# Altium schematic sheet FMC_Block_Diagram.SchDoc: FMC Block Diagram
size 381 x 241 mm; DrawnBy: Connor Dack; Engineer: Connor Dack; DocumentNumber: 5; Revision: 1.0; SheetNumber: 5; SheetTotal: 20
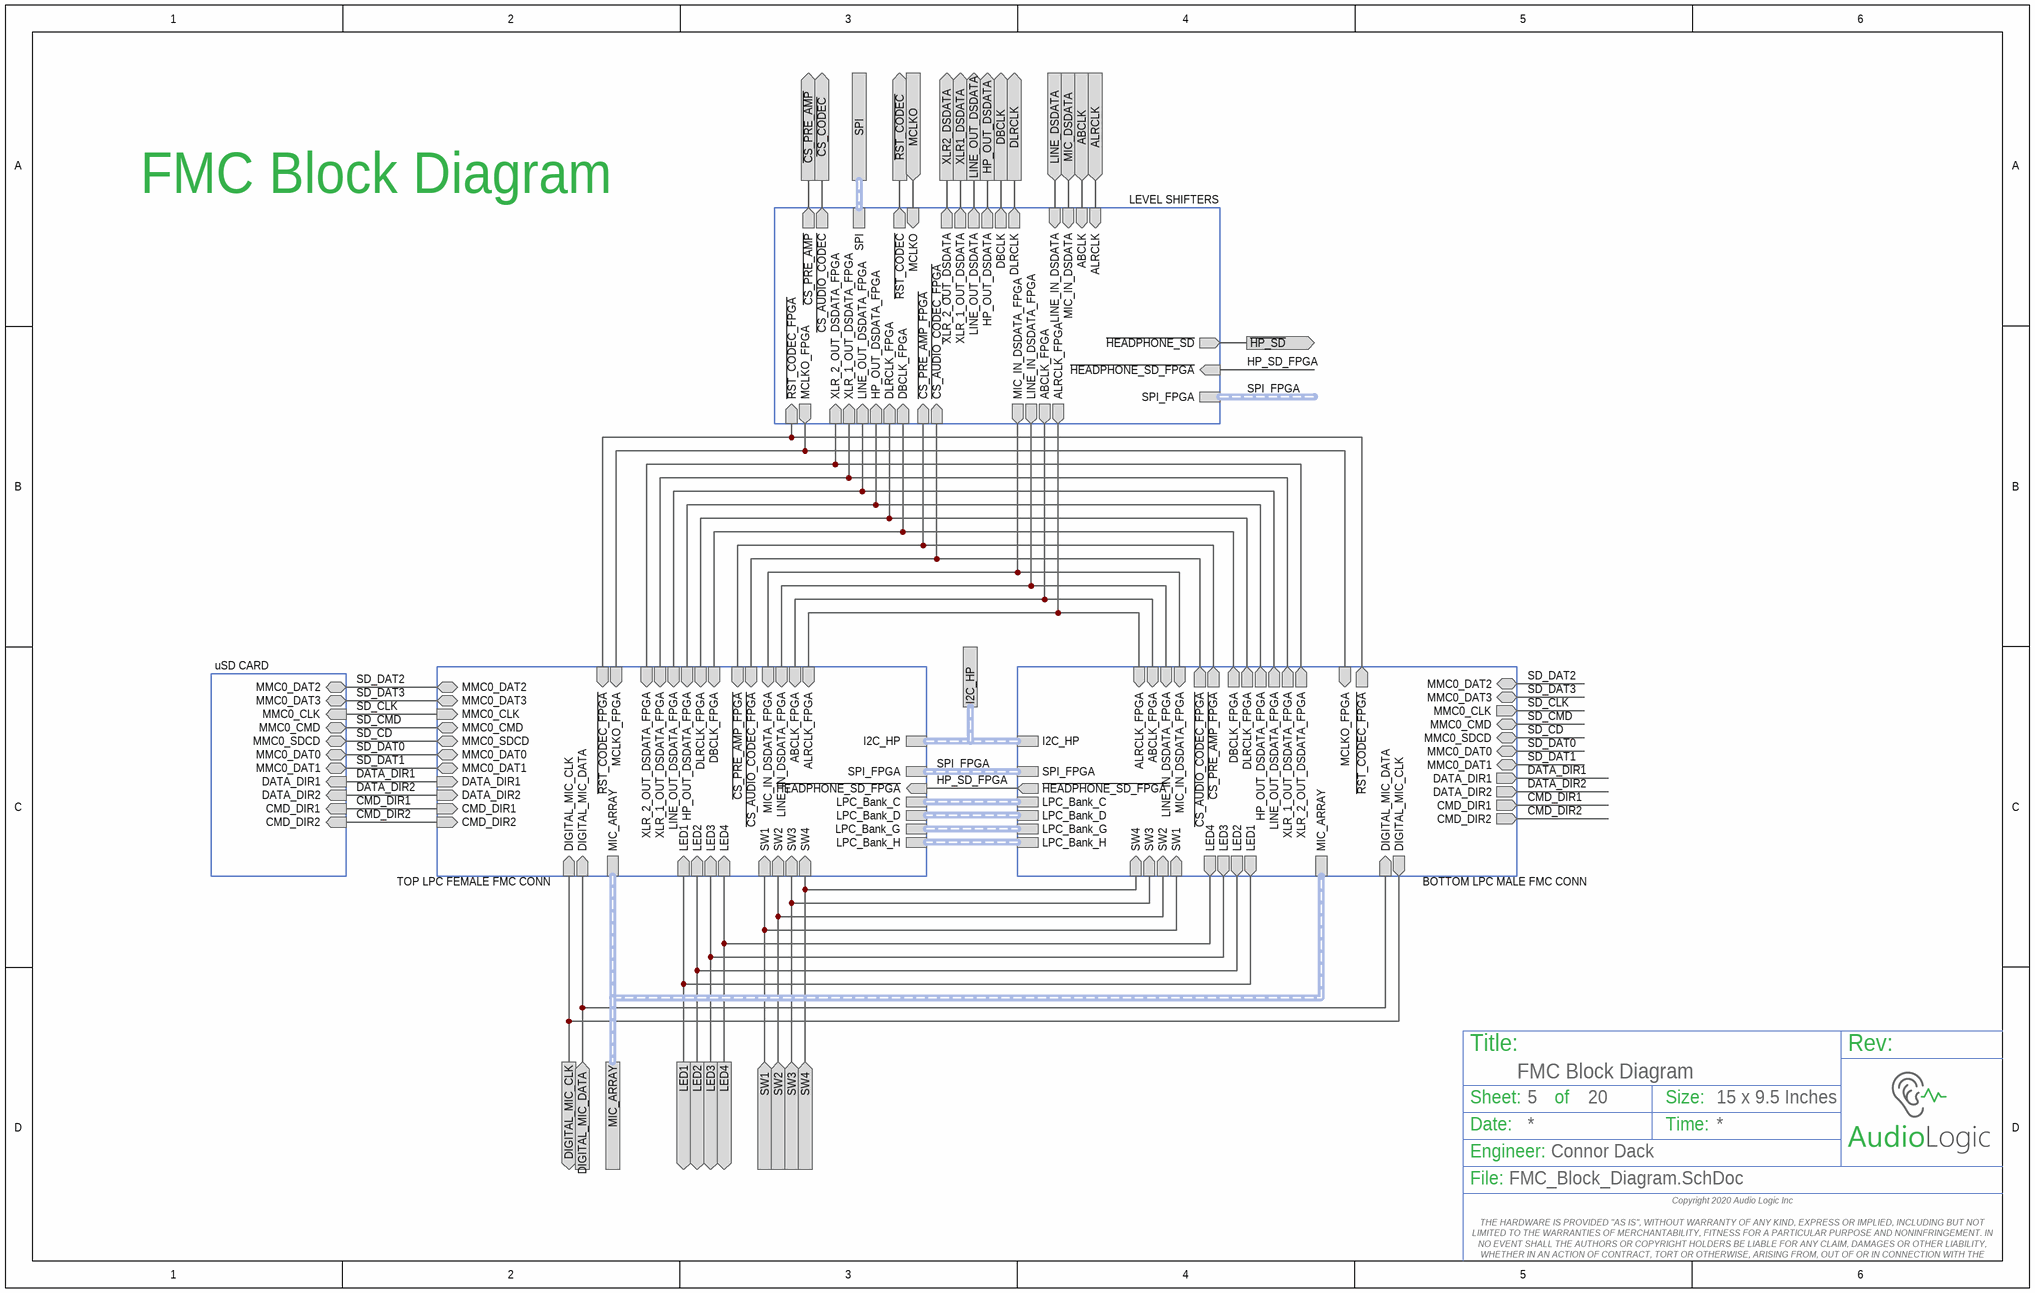
[diagram p0: FMC_Block_Diagram.SchDoc]

## Sub-sheets
BOTTOM LPC MALE FMC CONN = LPC_Male_FMC.SchDoc: SW1 (in), SW3 (in), SW2 (in), SW4 (in), LED1 (out), LED2 (out), LED3 (out), LED4 (out), MIC_ARRAY (harness Microphone Array), ABCLK_FPGA (in), ALRCLK_FPGA (in), DBCLK_FPGA (out), DLRCLK_FPGA (out), HP_OUT_DSDATA_FPGA (out), ~{HEADPHONE_SD_FPGA} (out), LINE_IN_DSDATA_FPGA (in), LINE_OUT_DSDATA_FPGA (out), MCLKO_FPGA (in), MIC_IN_DSDATA_FPGA (in), XLR_1_OUT_DSDATA_FPGA (out), XLR_2_OUT_DSDATA_FPGA (out), ~{RST_CODEC_FPGA} (out), SPI_FPGA (harness SPI_FPGA), ~{CS_AUDIO_CODEC_FPGA} (out), ~{CS_PRE_AMP_FPGA} (out), DIGITAL_MIC_CLK (out), DIGITAL_MIC_DATA (in), I2C_HP (harness I2C), MMC0_DAT2 (bidir), MMC0_DAT3 (bidir), MMC0_CLK (out), MMC0_CMD (bidir), MMC0_SDCD (bidir), MMC0_DAT0 (bidir), MMC0_DAT1 (bidir), LPC_Bank_H (harness LPC_Bank_H), LPC_Bank_G (harness LPC_Bank_G), LPC_Bank_D (harness LPC_Bank_D), LPC_Bank_C (harness LPC_Bank_C), DATA_DIR1 (out), CMD_DIR1 (out), DATA_DIR2 (out), CMD_DIR2 (out)
LEVEL SHIFTERS = Level_Shifters.SchDoc: XLR_2_OUT_DSDATA_FPGA (in), XLR_1_OUT_DSDATA_FPGA (in), LINE_OUT_DSDATA_FPGA (in), MIC_IN_DSDATA_FPGA (out), HP_OUT_DSDATA_FPGA (in), MCLKO_FPGA (out), ~{RST_CODEC_FPGA} (in), ~{HEADPHONE_SD_FPGA} (in), DLRCLK_FPGA (in), DBCLK_FPGA (in), ALRCLK_FPGA (out), ABCLK_FPGA (out), LINE_IN_DSDATA_FPGA (out), XLR_2_OUT_DSDATA (out), HP_OUT_DSDATA (out), MCLKO (in), XLR_1_OUT_DSDATA (out), LINE_OUT_DSDATA (out), MIC_IN_DSDATA (in), ~{RST_CODEC} (out), ~{HEADPHONE_SD} (out), DLRCLK (out), DBCLK (out), ALRCLK (in), ABCLK (in), LINE_IN_DSDATA (in), SPI (harness SPI), SPI_FPGA (harness SPI_FPGA), ~{CS_AUDIO_CODEC} (out), ~{CS_AUDIO_CODEC_FPGA} (in), ~{CS_PRE_AMP} (out), ~{CS_PRE_AMP_FPGA} (in)
TOP LPC FEMALE FMC CONN = LPC_Female_FMC.SchDoc: SW1 (in), SW3 (in), SW2 (in), SW4 (in), LED1 (in), LED2 (in), MIC_ARRAY (harness Microphone Array), LED3 (in), LED4 (in), DBCLK_FPGA (in), DLRCLK_FPGA (in), MIC_IN_DSDATA_FPGA (in), DIGITAL_MIC_DATA (in), ~{HEADPHONE_SD_FPGA} (in), DIGITAL_MIC_CLK (in), MCLKO_FPGA (in), ~{RST_CODEC_FPGA} (in), ALRCLK_FPGA (in), ABCLK_FPGA (in), LINE_IN_DSDATA_FPGA (in), SPI_FPGA (harness SPI_FPGA), HP_OUT_DSDATA_FPGA (in), LINE_OUT_DSDATA_FPGA (in), XLR_1_OUT_DSDATA_FPGA (in), XLR_2_OUT_DSDATA_FPGA (in), ~{CS_AUDIO_CODEC_FPGA} (in), ~{CS_PRE_AMP_FPGA} (in), I2C_HP (harness I2C), MMC0_DAT2 (bidir), MMC0_DAT3 (bidir), MMC0_CLK (in), MMC0_CMD (bidir), MMC0_SDCD (bidir), MMC0_DAT0 (bidir), MMC0_DAT1 (bidir), LPC_Bank_H (harness LPC_Bank_H), LPC_Bank_G (harness LPC_Bank_G), LPC_Bank_D (harness LPC_Bank_D), LPC_Bank_C (harness LPC_Bank_C), DATA_DIR1 (in), CMD_DIR1 (in), DATA_DIR2 (in), CMD_DIR2 (in)
uSD CARD = SD_Card.SchDoc: MMC0_DAT2 (bidir), MMC0_DAT3 (bidir), MMC0_CLK (in), MMC0_CMD (bidir), MMC0_SDCD (bidir), MMC0_DAT0 (bidir), MMC0_DAT1 (bidir), DATA_DIR1 (in), CMD_DIR1 (in), DATA_DIR2 (in), CMD_DIR2 (in)

## Ports
ABCLK (in), ALRCLK (in), DBCLK (out), DIGITAL_MIC_CLK (out), DIGITAL_MIC_DATA (in), DLRCLK (out), HP_OUT_DSDATA (out), I2C_HP, LED1 (out), LED2 (out), LED3 (out), LED4 (out), LINE_DSDATA (in), LINE_OUT_DSDATA (out), MCLKO (in), MIC_ARRAY, MIC_DSDATA (in), SPI, SW1 (in), SW2 (in), SW3 (in), SW4 (in), XLR1_DSDATA (out), XLR2_DSDATA (out), ~{CS_CODEC} (out), ~{CS_PRE_AMP} (out), ~{HP_SD} (out), ~{RST_CODEC} (out)

## Nets
~{HP_SD}: port ~{HP_SD}, sheet LEVEL SHIFTERS/~{HEADPHONE_SD}
ABCLK: port ABCLK, sheet LEVEL SHIFTERS/ABCLK
ALRCLK: port ALRCLK, sheet LEVEL SHIFTERS/ALRCLK
~{CS_CODEC}: port ~{CS_CODEC}, sheet LEVEL SHIFTERS/~{CS_AUDIO_CODEC}
~{CS_PRE_AMP}: port ~{CS_PRE_AMP}, sheet LEVEL SHIFTERS/~{CS_PRE_AMP}
CMD_DIR1: sheet TOP LPC FEMALE FMC CONN/CMD_DIR1, sheet BOTTOM LPC MALE FMC CONN/CMD_DIR1, sheet uSD CARD/CMD_DIR1
CMD_DIR2: sheet TOP LPC FEMALE FMC CONN/CMD_DIR2, sheet BOTTOM LPC MALE FMC CONN/CMD_DIR2, sheet uSD CARD/CMD_DIR2
DATA_DIR1: sheet TOP LPC FEMALE FMC CONN/DATA_DIR1, sheet BOTTOM LPC MALE FMC CONN/DATA_DIR1, sheet uSD CARD/DATA_DIR1
DATA_DIR2: sheet TOP LPC FEMALE FMC CONN/DATA_DIR2, sheet BOTTOM LPC MALE FMC CONN/DATA_DIR2, sheet uSD CARD/DATA_DIR2
DBCLK: port DBCLK, sheet LEVEL SHIFTERS/DBCLK
DIGITAL_MIC_CLK: port DIGITAL_MIC_CLK, sheet TOP LPC FEMALE FMC CONN/DIGITAL_MIC_CLK, sheet BOTTOM LPC MALE FMC CONN/DIGITAL_MIC_CLK
DIGITAL_MIC_DATA: port DIGITAL_MIC_DATA, sheet TOP LPC FEMALE FMC CONN/DIGITAL_MIC_DATA, sheet BOTTOM LPC MALE FMC CONN/DIGITAL_MIC_DATA
DLRCLK: port DLRCLK, sheet LEVEL SHIFTERS/DLRCLK
HP_OUT_DSDATA: port HP_OUT_DSDATA, sheet LEVEL SHIFTERS/HP_OUT_DSDATA
HP_SD_FPGA: sheet TOP LPC FEMALE FMC CONN/~{HEADPHONE_SD_FPGA}, sheet BOTTOM LPC MALE FMC CONN/~{HEADPHONE_SD_FPGA}, sheet LEVEL SHIFTERS/~{HEADPHONE_SD_FPGA}
LED1: port LED1, sheet TOP LPC FEMALE FMC CONN/LED1, sheet BOTTOM LPC MALE FMC CONN/LED1
LED2: port LED2, sheet TOP LPC FEMALE FMC CONN/LED2, sheet BOTTOM LPC MALE FMC CONN/LED2
LED3: port LED3, sheet TOP LPC FEMALE FMC CONN/LED3, sheet BOTTOM LPC MALE FMC CONN/LED3
LED4: port LED4, sheet TOP LPC FEMALE FMC CONN/LED4, sheet BOTTOM LPC MALE FMC CONN/LED4
LINE_DSDATA: port LINE_DSDATA, sheet LEVEL SHIFTERS/LINE_IN_DSDATA
LINE_OUT_DSDATA: port LINE_OUT_DSDATA, sheet LEVEL SHIFTERS/LINE_OUT_DSDATA
MCLKO: port MCLKO, sheet LEVEL SHIFTERS/MCLKO
MIC_DSDATA: port MIC_DSDATA, sheet LEVEL SHIFTERS/MIC_IN_DSDATA
~{RST_CODEC}: port ~{RST_CODEC}, sheet LEVEL SHIFTERS/~{RST_CODEC}
SD_CD: sheet TOP LPC FEMALE FMC CONN/MMC0_SDCD, sheet BOTTOM LPC MALE FMC CONN/MMC0_SDCD, sheet uSD CARD/MMC0_SDCD
SD_CLK: sheet TOP LPC FEMALE FMC CONN/MMC0_CLK, sheet BOTTOM LPC MALE FMC CONN/MMC0_CLK, sheet uSD CARD/MMC0_CLK
SD_CMD: sheet TOP LPC FEMALE FMC CONN/MMC0_CMD, sheet BOTTOM LPC MALE FMC CONN/MMC0_CMD, sheet uSD CARD/MMC0_CMD
SD_DAT0: sheet TOP LPC FEMALE FMC CONN/MMC0_DAT0, sheet BOTTOM LPC MALE FMC CONN/MMC0_DAT0, sheet uSD CARD/MMC0_DAT0
SD_DAT1: sheet TOP LPC FEMALE FMC CONN/MMC0_DAT1, sheet BOTTOM LPC MALE FMC CONN/MMC0_DAT1, sheet uSD CARD/MMC0_DAT1
SD_DAT2: sheet TOP LPC FEMALE FMC CONN/MMC0_DAT2, sheet BOTTOM LPC MALE FMC CONN/MMC0_DAT2, sheet uSD CARD/MMC0_DAT2
SD_DAT3: sheet TOP LPC FEMALE FMC CONN/MMC0_DAT3, sheet BOTTOM LPC MALE FMC CONN/MMC0_DAT3, sheet uSD CARD/MMC0_DAT3
SW1: port SW1, sheet TOP LPC FEMALE FMC CONN/SW1, sheet BOTTOM LPC MALE FMC CONN/SW1
SW2: port SW2, sheet TOP LPC FEMALE FMC CONN/SW2, sheet BOTTOM LPC MALE FMC CONN/SW2
SW3: port SW3, sheet TOP LPC FEMALE FMC CONN/SW3, sheet BOTTOM LPC MALE FMC CONN/SW3
SW4: port SW4, sheet TOP LPC FEMALE FMC CONN/SW4, sheet BOTTOM LPC MALE FMC CONN/SW4
XLR1_DSDATA: port XLR1_DSDATA, sheet LEVEL SHIFTERS/XLR_1_OUT_DSDATA
XLR2_DSDATA: port XLR2_DSDATA, sheet LEVEL SHIFTERS/XLR_2_OUT_DSDATA
(unnamed): sheet TOP LPC FEMALE FMC CONN/DBCLK_FPGA, sheet BOTTOM LPC MALE FMC CONN/DBCLK_FPGA, sheet LEVEL SHIFTERS/DBCLK_FPGA
(unnamed): sheet TOP LPC FEMALE FMC CONN/DLRCLK_FPGA, sheet BOTTOM LPC MALE FMC CONN/DLRCLK_FPGA, sheet LEVEL SHIFTERS/DLRCLK_FPGA
(unnamed): sheet TOP LPC FEMALE FMC CONN/MIC_IN_DSDATA_FPGA, sheet BOTTOM LPC MALE FMC CONN/MIC_IN_DSDATA_FPGA, sheet LEVEL SHIFTERS/MIC_IN_DSDATA_FPGA
(unnamed): sheet TOP LPC FEMALE FMC CONN/MCLKO_FPGA, sheet BOTTOM LPC MALE FMC CONN/MCLKO_FPGA, sheet LEVEL SHIFTERS/MCLKO_FPGA
(unnamed): sheet TOP LPC FEMALE FMC CONN/~{RST_CODEC_FPGA}, sheet BOTTOM LPC MALE FMC CONN/~{RST_CODEC_FPGA}, sheet LEVEL SHIFTERS/~{RST_CODEC_FPGA}
(unnamed): sheet TOP LPC FEMALE FMC CONN/ALRCLK_FPGA, sheet BOTTOM LPC MALE FMC CONN/ALRCLK_FPGA, sheet LEVEL SHIFTERS/ALRCLK_FPGA
(unnamed): sheet TOP LPC FEMALE FMC CONN/ABCLK_FPGA, sheet BOTTOM LPC MALE FMC CONN/ABCLK_FPGA, sheet LEVEL SHIFTERS/ABCLK_FPGA
(unnamed): sheet TOP LPC FEMALE FMC CONN/LINE_IN_DSDATA_FPGA, sheet BOTTOM LPC MALE FMC CONN/LINE_IN_DSDATA_FPGA, sheet LEVEL SHIFTERS/LINE_IN_DSDATA_FPGA
(unnamed): sheet TOP LPC FEMALE FMC CONN/HP_OUT_DSDATA_FPGA, sheet BOTTOM LPC MALE FMC CONN/HP_OUT_DSDATA_FPGA, sheet LEVEL SHIFTERS/HP_OUT_DSDATA_FPGA
(unnamed): sheet TOP LPC FEMALE FMC CONN/LINE_OUT_DSDATA_FPGA, sheet BOTTOM LPC MALE FMC CONN/LINE_OUT_DSDATA_FPGA, sheet LEVEL SHIFTERS/LINE_OUT_DSDATA_FPGA
(unnamed): sheet TOP LPC FEMALE FMC CONN/XLR_1_OUT_DSDATA_FPGA, sheet BOTTOM LPC MALE FMC CONN/XLR_1_OUT_DSDATA_FPGA, sheet LEVEL SHIFTERS/XLR_1_OUT_DSDATA_FPGA
(unnamed): sheet TOP LPC FEMALE FMC CONN/XLR_2_OUT_DSDATA_FPGA, sheet BOTTOM LPC MALE FMC CONN/XLR_2_OUT_DSDATA_FPGA, sheet LEVEL SHIFTERS/XLR_2_OUT_DSDATA_FPGA
(unnamed): sheet TOP LPC FEMALE FMC CONN/~{CS_AUDIO_CODEC_FPGA}, sheet BOTTOM LPC MALE FMC CONN/~{CS_AUDIO_CODEC_FPGA}, sheet LEVEL SHIFTERS/~{CS_AUDIO_CODEC_FPGA}
(unnamed): sheet TOP LPC FEMALE FMC CONN/~{CS_PRE_AMP_FPGA}, sheet BOTTOM LPC MALE FMC CONN/~{CS_PRE_AMP_FPGA}, sheet LEVEL SHIFTERS/~{CS_PRE_AMP_FPGA}

## Buses and harness runs
harness port I2C_HP = sheet BOTTOM LPC MALE FMC CONN/I2C_HP = sheet TOP LPC FEMALE FMC CONN/I2C_HP
harness port MIC_ARRAY = sheet BOTTOM LPC MALE FMC CONN/MIC_ARRAY = sheet TOP LPC FEMALE FMC CONN/MIC_ARRAY
harness port SPI = sheet LEVEL SHIFTERS/SPI
harness sheet BOTTOM LPC MALE FMC CONN/LPC_Bank_C = sheet TOP LPC FEMALE FMC CONN/LPC_Bank_C
harness sheet BOTTOM LPC MALE FMC CONN/LPC_Bank_D = sheet TOP LPC FEMALE FMC CONN/LPC_Bank_D
harness sheet BOTTOM LPC MALE FMC CONN/LPC_Bank_G = sheet TOP LPC FEMALE FMC CONN/LPC_Bank_G
harness sheet BOTTOM LPC MALE FMC CONN/LPC_Bank_H = sheet TOP LPC FEMALE FMC CONN/LPC_Bank_H
harness SPI_FPGA = sheet BOTTOM LPC MALE FMC CONN/SPI_FPGA = sheet TOP LPC FEMALE FMC CONN/SPI_FPGA
harness SPI_FPGA = sheet LEVEL SHIFTERS/SPI_FPGA

## Notes on the sheet
- FMC Block Diagram
- Title:
- Sheet:
- of
- Size:
- 15 x 9.5 Inches
- Rev:
- Date:
- Engineer:
- Time:
- File:
- Copyright 2020 Audio Logic Inc
  THE HARDWARE IS PROVIDED "AS IS", WITHOUT WARRANTY OF ANY KIND, EXPRESS OR IMPLIED, INCLUDING BUT NOT LIMITED TO THE WARRANTIES OF MERCHANTABILITY, FITNESS FOR A PARTICULAR PURPOSE AND NONINFRINGEMENT. IN NO EVENT SHALL THE AUTHORS OR COPYRIGHT HOLDERS BE LIABLE FOR ANY CLAIM, DAMAGES OR OTHER LIABILITY, WHETHER IN AN ACTION OF CONTRACT, TORT OR OTHERWISE, ARISING FROM, OUT OF OR IN CONNECTION WITH THE HARDWARE OR THE USE OR OTHER DEALINGS IN THE HARDWARE.